# Altium project lab1_kondratchenko_usb_rs485.PrjPcb
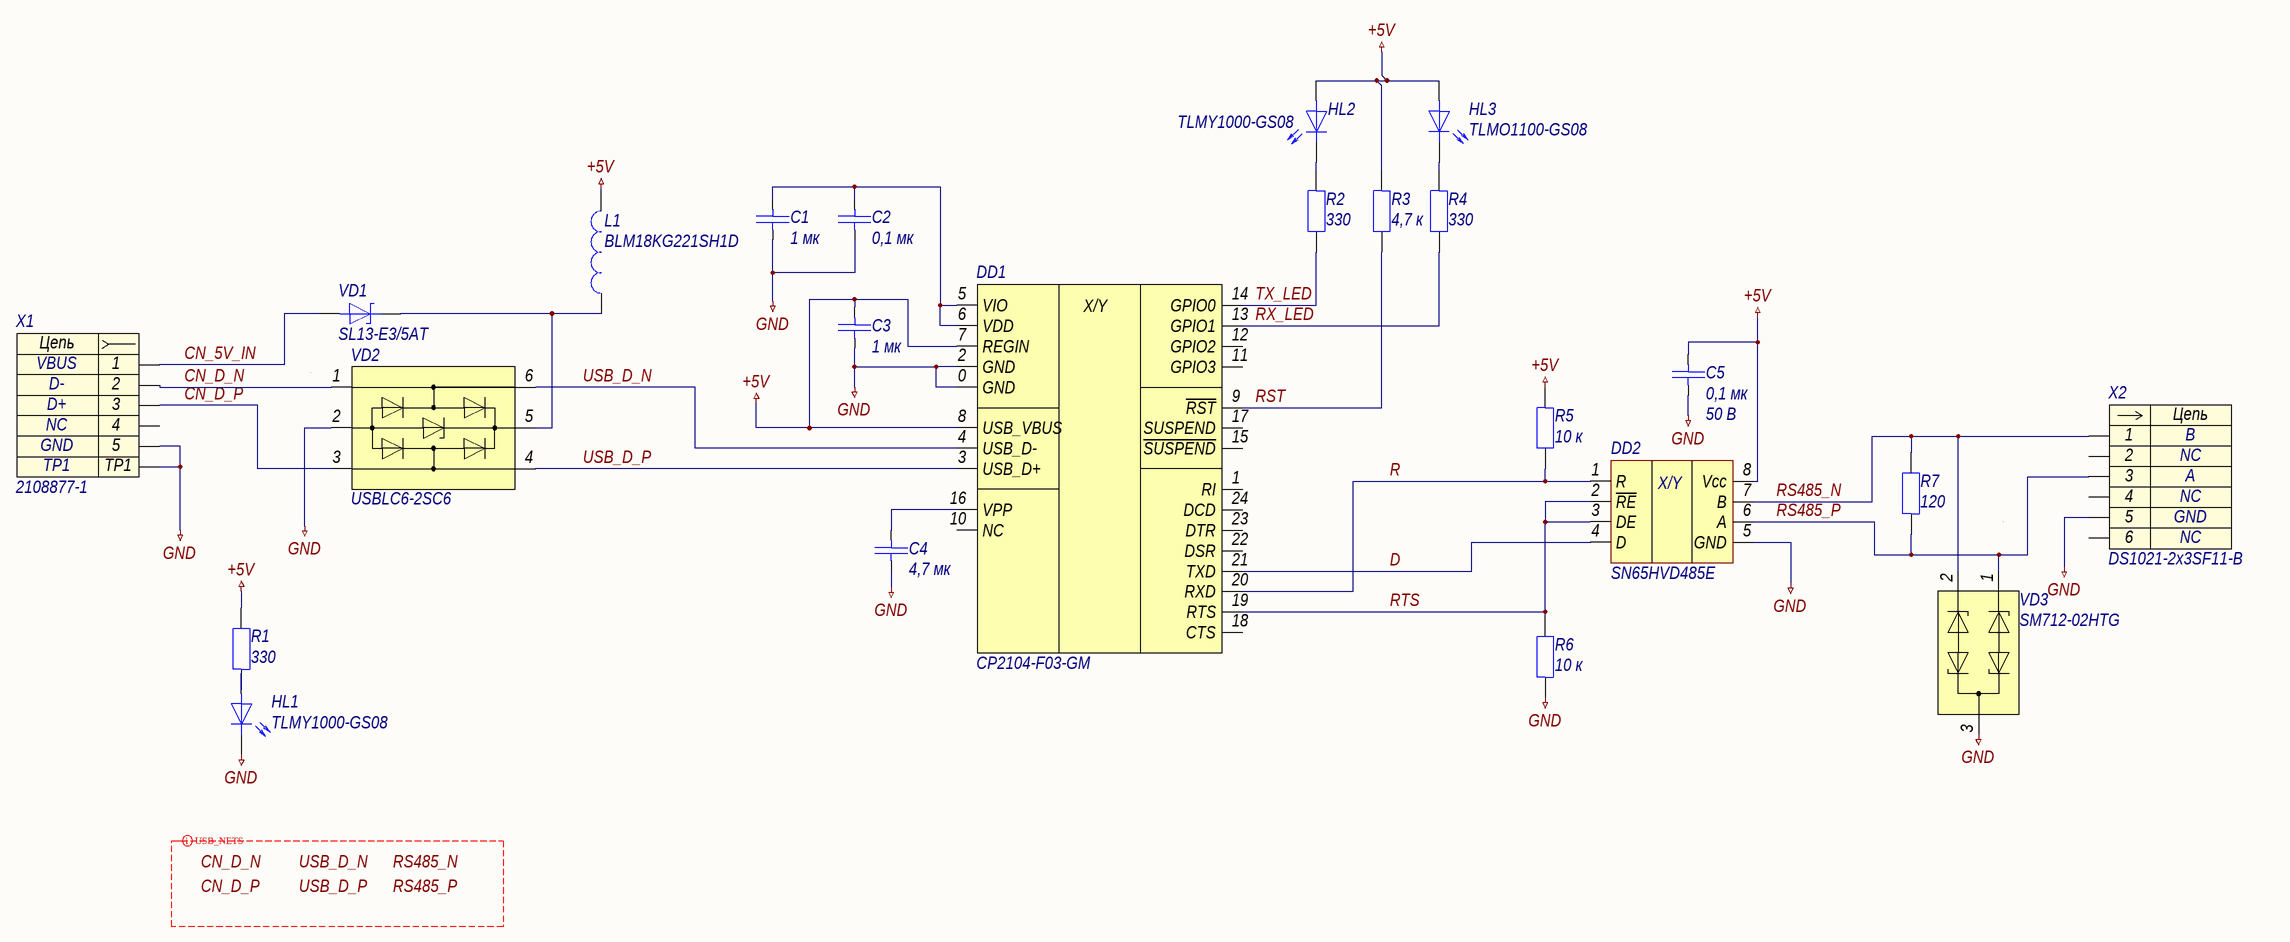
[diagram p0: lab1_kondratchenko_usb_rs485.SchDoc]
approver: Капустин; check: Капустин; designation: СПБПУ.3331506.014; developer: Кондратченко; document_code: Ý3; document_type: Схема электрическая принципиальная; pcb_dec_number: СПБПУ.3331506.014; project: Преобразователь USB-RS485; title: Преобразователь USB-RS485; title_line_1: Преобразователь; title_line_2: USB-RS485
1 sheet, 23 parts. Net scope: global (net labels, ports and power ports of the same name join across sheets).
Board file: lab1_kondratchenko_usb_rs485.PcbDoc

## Sheet lab1_kondratchenko_usb_rs485.SchDoc: Преобразователь USB-RS485
size 594 x 420 mm; ApprovedBy: Капустин; CheckedBy: Капустин; DrawnBy: Кондратченко; DocumentNumber: СПБПУ.3331506.014Ý3; SheetNumber: n; DocumentCode: Ý3; ImagePath: СПБПУ.3331506.014

### Parts
C1  1 мк  [C0603]
C2  0,1 мк  [C0603]
C3  1 мк  [C0603]
C4  4,7 мк  [C0603]
C5  0,1 мк  Напряжение: 50 В  [C0603]
DD1  CP2104-F03-GM  [QFN-24-400X400X80]
DD2  SN65HVD485E  [D0008A]
HL1  TLMY1000-GS08  [HL0603]
HL2  TLMY1000-GS08  [HL0603]
HL3  TLMO1100-GS08  [HL0603]
L1  BLM18KG221SH1D  [BLM-2-0603]
R1  330  [R0603]
R2  330  [R0603]
R3  4,7 к  [R0603]
R4  330  [R0603]
R5  10 к  [R0603]
R6  10 к  [R0603]
R7  120  [R0603]
VD1  SL13-E3/5AT  [DO-214AC]
VD2  USBLC6-2SC6  [SOT-23-6]
VD3  SM712-02HTG  [SOT-23-3]
X1  2108877-1  [2108877-1]
X2  DS1021-2x3SF11-B  [DS1021-2X3SF11-B]

### Nets
+5V: C3.2 C5.2 DD1.7(REGIN) DD1.8(USB_VBUS) DD2.8(Vcc) HL2.2 HL3.2 L1.2 R1.2 R3.1 R5.1
GND: C1.1 C2.1 C3.1 C4.1 C5.1 DD1.0(GND) DD1.2(GND) DD2.5(GND) HL1.1 R6.1 VD2.2 VD3.3 X1.5 X1.TP1 X2.5
CN_5V_IN: VD1.2 X1.1
CN_D_N: VD2.1 X1.2
CN_D_P: VD2.3 X1.3
D: DD1.21(TXD) DD2.4(D)
R: DD1.20(RXD) DD2.1(R) R5.2
RS485_N: DD2.7(B) R7.2 VD3.2 X2.1
RS485_P: DD2.6(A) R7.1 VD3.1 X2.3
RST: DD1.9(~{RST}) R3.2
RTS: DD1.19(RTS) DD2.2(~{RE}) DD2.3(DE) R6.2
RX_LED: DD1.13(GPIO1) R4.2
TX_LED: DD1.14(GPIO0) R2.2
USB_D_N: DD1.4(USB_D-) VD2.6
USB_D_P: DD1.3(USB_D+) VD2.4
NetC1_2: C1.2 C2.2 DD1.5(VIO) DD1.6(VDD)
NetC4_2: C4.2 DD1.16(VPP)
NetHL1_2: HL1.2 R1.1
NetHL2_1: HL2.1 R2.1
NetHL3_1: HL3.1 R4.1
NetL1_1: L1.1 VD1.1 VD2.5

Not connected (* = marked no-connect by the designer): DD1 1(RI) 10(NC) 11(GPIO3) 12(GPIO2) 15(~{SUSPEND}) 17(SUSPEND) 18(CTS) 22(DSR) 23(DTR) 24(DCD); X1 4; X2 2 4 6

### Layout directives
differential pair; differential pair class USB_SIGNALS; rule Differential Pairs Routing [Pref Gap = 0.254mm    Min Gap  = 0.15mm    Max Gap  = 0.254mmPref Width = 0.381mm    Min Width  = 0.155mm    Max Width  = 0.381mm]: CN_D_N, CN_D_P, RS485_N, RS485_P, USB_D_N, USB_D_P

### Notes on the sheet
- Labels drawn without touching a wire or pin: CN_D_N, CN_D_P, RS485_N, RS485_P, USB_D_N, USB_D_P
- Перв. примен.
- Справ. №
- Подп. и дата
- Инв. № дубл.
- Нормоконтроль:
- Взам. инв. №
- Изм.
- Лист
- № докум.
- Подп.
- Дата
- Лит.
- Масса
- Масштаб
- Т.контр.
- Пров.
- Разраб.
- Листов
- Разработал:
- Инв. № подл.
- Н.контр.
- Утв.
- Копировал
- Формат
- А2
- (in symbol dd0001) X/Y
- (in symbol SN65HVD485E) X/Y
- (in symbol x0001) Цепь
- (in symbol x0022) Цепь

### Library data of the parts
C1 C3 = c0090: =Описание; ID: c0090; Фамилия: Ларионов; Описание: Конденсатор керамический чип 0603 1 мкФ 25 В ±10 %; Наименование: CC0603KRX7R8BB105; Производитель: YAGEO Corp.; Отклонение: ±10 %; Номинальное напряжение: 25 В; Рабочие температуры: от –55 °С до +125 °С; Температурный коэффициент емкости: X7R; Корпус: 0603; Номинал: 1 мк; HelpURL: https://www.yageo.com/upload/media/product/productsearch/datasheet/mlcc/UPY-GPHC_X7R_6.3V-to-50V_20.pdf
C2 = c0060: =Описание; ID: c0060; Фамилия: Ларионов; Описание: Конденсатор керамический чип 0603 100 нФ 50 В ±5 %; Наименование: CC0603JRX7R9BB104; Производитель: YAGEO Corp.; Отклонение: ±5 %; Номинальное напряжение: 50 В; Рабочие температуры: от –55 °С до +125 °С; Температурный коэффициент емкости: X7R; Корпус: 0603; Номинал: 0,1 мк; HelpURL: https://www.yageo.com/upload/media/product/productsearch/datasheet/mlcc/UPY-GPHC_X7R_6.3V-to-50V_20.pdf
C4 = c0111: =Описание; ID: c0111; Фамилия: Ларионов; Описание: Конденсатор керамический чип 0603 4,7 мкФ 25 В ±10 %; Наименование: CC0603KRX5R8BB475; Производитель: YAGEO Corp.; Отклонение: ±10 %; Номинальное напряжение: 25 В; Рабочие температуры: от –55 °С до +85 °С; Температурный коэффициент емкости: X5R; Корпус: 0603; Номинал: 4,7 мк; HelpURL: https://www.yageo.com/upload/media/product/productsearch/datasheet/mlcc/UPY-GPHC_X5R_4V-to-50V_26.pdf
C5 = c0060: =Описание; ID: c0060; Фамилия: Ларионов; Описание: Конденсатор керамический чип 0603 100 нФ 50 В ±5 %; Наименование: CC0603JRX7R9BB104; Производитель: YAGEO Corp.; Отклонение: ±5 %; Рабочие температуры: от –55 °С до +125 °С; Температурный коэффициент емкости: X7R; Корпус: 0603; Номинал: 0,1 мк; Номинальное напряжение: 50 В; HelpURL: https://www.yageo.com/upload/media/product/productsearch/datasheet/mlcc/UPY-GPHC_X7R_6.3V-to-50V_20.pdf
DD1 = dd0001: =Описание; ID: dd0001; Фамилия: Ларионов; Описание: Преобразователь USB-UART; Производитель: Silicon Laboratories; Корпус: QFN-24; Наименование: CP2104-F03-GM; HelpURL: https://www.silabs.com/interface/usb-bridges/classic/device.cp2104
DD2 = SN65HVD485E: =Описание
HL1 HL2 = hl0003: =Описание; ID: hl0003; Фамилия: Ларионов; Описание: Светодиод чип 0603 желтый; Производитель: Vishay Intertechnology, Inc.; Номинальная сила света: 7,5 мкд; Номинальная длина волны: 588 нм; Номинальный прямой ток: 15 мА; Номинальное падение напряжения: 1,8 В; Рассеиваемая мощность: 40 мВт; Рабочие температуры: от –40 °С до +100 °С; Корпус: 0603; Наименование: TLMY1000-GS08; HelpURL: https://www.vishay.com/leds/list/product-83172/
HL3 = hl0004: =Описание; ID: hl0004; Фамилия: Ларионов; Описание: Светодиод чип 0603 оранжевый; Производитель: Vishay Intertechnology, Inc.; Номинальная сила света: 80 мкд; Номинальная длина волны: 606 нм; Номинальный прямой ток: 30 мА; Номинальное падение напряжения: 2,1 В; Рассеиваемая мощность: 90 мВт; Рабочие температуры: от –40 °С до +100 °С; Корпус: 0603; Наименование: TLMO1100-GS08; HelpURL: https://www.vishay.com/leds/list/product-83173/
L1 = l0001: =Описание; ID: l0001; Фамилия: Ларионов; Описание: Ферритовая бусина 220 Ом ±25 %; Производитель: Murata Manufacturing Co., Ltd.; Сопротивление, 100 МГц: 220 Ом; Отклонение, 100 МГц: ±25 %; Сопротивление при постоянном токе: 0,05 Ом; Рабочие температуры: от –55 °С до +125 °С; Корпус: 0603; Наименование: BLM18KG221SH1D; HelpURL: https://www.murata.com/en-global/products/productdetail?partno=BLM18KG221SH1%23
R1 = r0005: =Описание; ID: r0005; Фамилия: Ларионов; Описание: Резистор чип 0603 330 Ом ±1 % 0,1 Вт; Наименование: RC0603FR-07330RL; Производитель: Yageo; Отклонение: ±1 %; Номинальное напряжение: 75 В; Рабочие температуры: от -55 °С до +155 °С; Номинальный ток: 1 А; Корпус: 0603; Номинал: 330; HelpURL: https://www.yageo.com/upload/media/product/productsearch/datasheet/rchip/PYu-RC_Group_51_RoHS_L_11.pdf
R2 R4 = r0019: =Описание; ID: r0019; Фамилия: Ларионов; Описание: Резистор чип 0603 330 Ом ±1 % 0,1 Вт; Наименование: RC0603FR-07330RL; Производитель: YAGEO Corp.; Отклонение: ±1 %; Номинальное напряжение: 75 В; Номинальный ток: 1 А; Рабочие температуры: от –55 °С до +155 °С; Корпус: 0603; Примечание: Ряд E24; Номинал: 330; HelpURL: https://www.yageo.com/upload/media/product/productsearch/datasheet/rchip/PYu-RC_Group_51_RoHS_L_11.pdf
R3 = r0049: =Описание; ID: r0049; Фамилия: Ларионов; Описание: Резистор чип 0603 4,7 кОм ±1 % 0,1 Вт; Наименование: RC0603FR-074K7L; Производитель: YAGEO Corp.; Отклонение: ±1 %; Номинальное напряжение: 75 В; Номинальный ток: 1 А; Рабочие температуры: от –55 °С до +155 °С; Корпус: 0603; Примечание: Ряд E24; Номинал: 4,7 к; HelpURL: https://www.yageo.com/upload/media/product/productsearch/datasheet/rchip/PYu-RC_Group_51_RoHS_L_11.pdf
R5 R6 = r0060: =Описание; ID: r0060; Фамилия: Самарин; Описание: Резистор чип 0603 10 кОм ±1 % 0,1 Вт; Наименование: RC0603FR-0710KL; Производитель: YAGEO Corp.; Отклонение: ±1 %; Номинальное напряжение: 75 В; Номинальный ток: 1 А; Рабочие температуры: от –55 °С до +155 °С; Корпус: 0603; Примечание: Ряд E24; Номинал: 10 к; HelpURL: https://www.yageo.com/upload/media/product/productsearch/datasheet/rchip/PYu-RC_Group_51_RoHS_L_11.pdf
R7 = r0006: =Описание; ID: r0006; Фамилия: Самарин; Описание: Резистор чип 0603 120 Ом ±1 % 0,1 Вт; Наименование: RC0603FR‍‐07120RL; Производитель: Yageo; Отклонение: ±1 %; Номинальное напряжение: 75 В; Рабочие температуры: от -55 °С до +155 °С; Номинальный ток: 1 А; Корпус: 0603; Номинал: 120; HelpURL: https://www.yageo.com/upload/media/product/productsearch/datasheet/rchip/PYu-RC_Group_51_RoHS_L_11.pdf
VD1 = vd0003: =Описание; ID: vd0003; Фамилия: Ларионов; Описание: Диод Шоттки 30 В 1,5 А; Производитель: Vishay Intertechnology, Inc.; Максимальное прямое напряжение: 0,445 В; Максимальное обратное напряжение: 30 В; Максимальный прямой ток: 1,5 А; Рабочие температуры: от –55 °С до +125 °С; Наименование: SL13-E3/5AT; Корпус: DO-214AC; HelpURL: https://www.vishay.com/product?docid=88740
VD2 = vd0009: =Описание; ID: vd0009; Фамилия: Ларионов; Описание: Диодная сборка для подавления помех, от 6 В; Производитель: STMicroelectronics; Наименование: USBLC6-2SC6; Корпус: SOT-23-6; HelpURL: https://www.st.com/content/st_com/en/products/protection-devices/esd-protection/usb-port-protection/usblc6-2.html
VD3 = vd0002: =Описание; ID: vd0002; Фамилия: Самарин; Описание: Диодная сборка для подавления помех, –7/12 В; Производитель: Littelfuse, Inc.; Наименование: SM712-02HTG; Корпус: SOT-23-3; HelpURL: https://www.littelfuse.com/products/tvs-diode-arrays/general-purpose-esd-protection/sm712.aspx
X1 = x0001: Contact_1: VBUS; Contact_2: D-; Contact_3: D+; Contact_4: NC; Contact_5: GND; ID: x0001; Фамилия: Ларионов; Описание: USB 2.0 Micro USB Type B IP68 гнездо прямой угол; Производитель: TE Connectivity; Наименование: 2108877-1; HelpURL: https://www.te.com/global-en/product-2108877-1.html
X2 = x0022: =Описание; Contact_1: B; Contact_2: NC; Contact_3: A; Contact_5: GND; ID: x0022; Фамилия: Самарин; Описание: PLS 2x3 pin 2,54 мм вилка прямой; Производитель: Connfly Electronic Co., Ltd.; Contact_4: NC; Contact_6: NC; Наименование: DS1021-2x3SF11-B; HelpURL: http://en.connfly.group/product/xVkr=EusQssAN0gN=Aos=mU+UrVkR9kqEAN0gN9g+WqANB+A